# Altium schematic sheet POWER.SchDoc
size A4
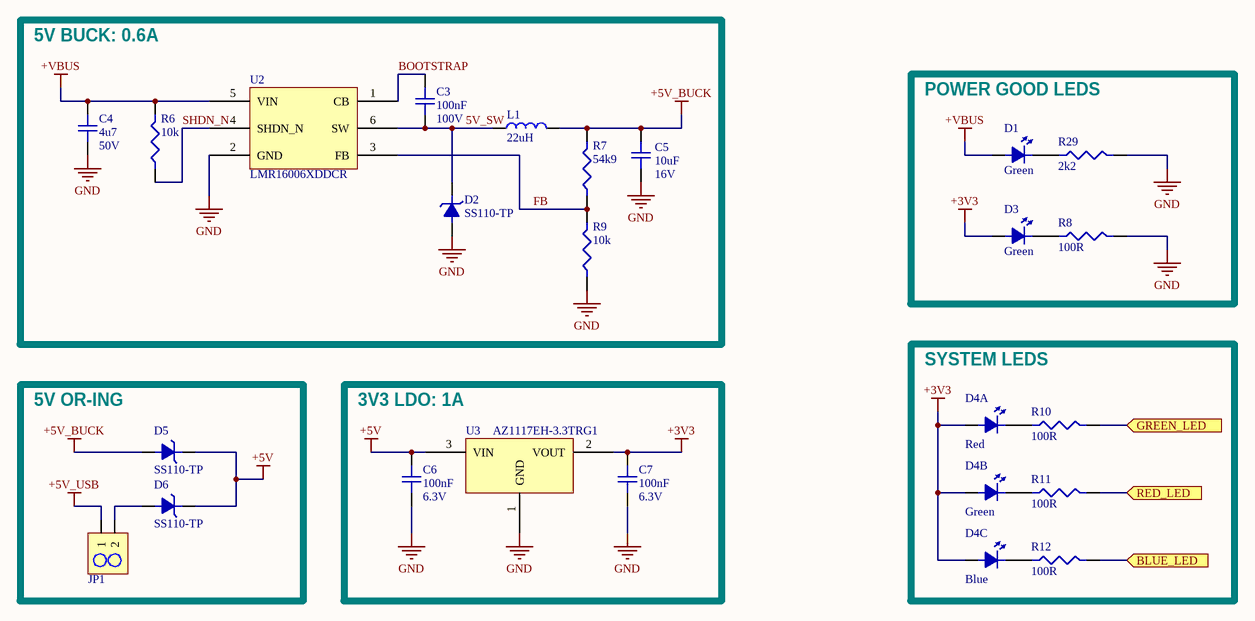
[diagram p0: POWER.SchDoc]

## Parts
C3  100nF  Voltage Rating: 100V  [C0805]
C4  4u7  Voltage Rating: 50V  [C0805]
C5  10uF  Voltage Rating: 16V  [C0805]
C6  100nF  Voltage Rating: 6.3V  [C0402]
C7  100nF  Voltage Rating: 6.3V  [C0402]
D1  Green  [LED_0603]
D2  SS110-TP  [DO-214AA_Diode]
D3  Green  [LED_0603]
D4  EAST1616RGBB4  [LED_TRICOLOR]  (value not drawn)  (parts A,B,C of 3)
D5  SS110-TP  [DO-214AA_Diode]
D6  SS110-TP  [DO-214AA_Diode]
JP1  952-2262-ND  [2PIN_HEADER]  (value not drawn)
L1  22uH  [INDUCTOR]
R6  10k  [R0402]
R7  54k9  [R0402]
R8  100R  [R0402]
R9  10k  [R0402]
R10  100R  [R0402]
R11  100R  [R0402]
R12  100R  [R0402]
R29  2k2  [R0402]
U2  LMR16006XDDCR  [SOT23-6_Lead]
U3  AZ1117EH-3.3TRG1  [SOT223]

## Blocks framed on the sheet
5V BUCK: 0.6A: C3-C5 D2 L1 R6 R7 R9 U2
POWER GOOD LEDS: D1 D3 R8 R29
SYSTEM LEDS: D4 R10-R12
5V OR-ING: D5 D6 JP1
3V3 LDO: 1A: C6 C7 U3

## Ports
BLUE_LED, GREEN_LED, RED_LED

## Nets
+3V3: C7.2 D3.1 D4.4 U3.2(VOUT)
+5V: C6.2 D5.2 D6.2 U3.3(VIN)
+5V_BUCK: C5.2 D5.1 L1.2 R7.2
+5V_USB: JP1.1
+VBUS: C4.2 D1.1 R6.2 U2.5(VIN)
GND: C4.1 C5.1 C6.1 C7.1 D2.1 R8.2 R9.1 R29.2 U2.2(GND) U3.1(GND)
5V_SW: C3.1 D2.2 L1.1 U2.6(SW)
BLUE_LED: R12.2 ; port BLUE_LED
BOOTSTRAP: C3.2 U2.1(CB)
FB: R7.1 R9.2 U2.3(FB)
GREEN_LED: R10.2 ; port GREEN_LED
RED_LED: R11.2 ; port RED_LED
SHDN_N: R6.1 U2.4(SHDN_N)
NetD1_2: D1.2 R29.1
NetD3_2: D3.2 R8.1
NetD4_1: D4.1 R10.1
NetD4_2: D4.2 R11.1
NetD4_3: D4.3 R12.1
NetD6_1: D6.1 JP1.2

## Notes on the sheet
- (in symbol EAST1616RGBB4, part A) Red
- (in symbol EAST1616RGBB4, part B) Green
- (in symbol EAST1616RGBB4, part C) Blue

## Library data of the parts
C3 = CL21B104KCFWPNE: CAP CER 0.10µF 100V Ceramic Capacitor X7R 0805 (2012 Metric) 0.079" L x 0.049" W (2.00mm x 1.25mm); Manufacturer: Samsung; Tolerance: 10%; Supplier 1: Digi-Key; Manufacturer Part Number: CL21B104KCFWPNE; Stock 1: 6000; Pricing 1: 1=0.17, 10=0.118, 100=0.0556, 500=0.039, 1000=0.0323 (USD); Mount: Surface Mount; Case/Package: 0805; Case Code (Metric): 2012; Case Code (Imperial): 0805; Min Operating Temperature: -55°C; Max Operating Temperature: 125°C; Packaging: Tape and Reel; Capacitance: 100nF; Length: 0.079inch; Width: 0.049inch; Thickness: 0.053inch; Supplier Part Number 1: 1276-6733-1-ND
C4 = CL21A475KBQNNNE: CAP CER 4.7uF 50V X5R 10% SMD 0805 85C Embossed T/R; Manufacturer: Samsung; Supplier 1: Digi-Key; Manufacturer Part Number: CL21A475KBQNNNE; Stock 1: 20000; Pricing 1: 1=0.44, 10=0.309, 100=0.1854, 500=0.1391, 1000=0.1174 (USD); Mount: Surface Mount; Case/Package: 0805; Case Code (Metric): 2012; Case Code (Imperial): 0805; Min Operating Temperature: -55°C; Max Operating Temperature: 85°C; Tolerance: 10%; Packaging: Tape and Reel; Package Quantity: 1; Capacitance: 4.7uF; Dielectric: X5R; Length: 2mm; Width: 0.049inch; Thickness: 0.055inch; Depth: 1.25mm; Radiation Hardening: No; ComponentLink1URL: https://datasheet.ciiva.com/25797/cl21a475kbqnnne-25797730.pdf; ComponentLink1Description: https://datasheet.ciiva.com/25797/cl21a475kbqnnne-25797730.pdf; ComponentLink2URL: https://datasheet.ciiva.com/26838/getdatasheetpartid-470982-26838620.pdf; ComponentLink2Description: https://datasheet.ciiva.com/26838/getdatasheetpartid-470982-26838620.pdf; ComponentLink3URL: https://datasheet.ciiva.com/16428/cl21a475kbqnnne-16428877.pdf; ComponentLink3Description: https://datasheet.ciiva.com/16428/cl21a475kbqnnne-16428877.pdf; Supplier Part Number 1: 1276-1248-1-ND
C5 = CL21A106KOQNNNE: CAP CER 10uF 16V X5R 10% SMD 0805 85C T/R; Manufacturer: Samsung; Dielectric: X7R; Supplier 1: Digi-Key; Manufacturer Part Number: CL21A106KOQNNNE; Stock 1: 20000; Pricing 1: 1=0.21, 10=0.148, 100=0.0698, 500=0.0489, 1000=0.0405 (USD); Mount: Surface Mount; Case/Package: 0805; Case Code (Metric): 2012; Case Code (Imperial): 0805; Min Operating Temperature: -55°C; Max Operating Temperature: 85°C; Package Quantity: 1; Packaging: Tape and Reel; Capacitance: 10uF; Tolerance: 10%; Voltage Rating (DC): 16V; Voltage: 16V; Length: 2mm; Height: 1.25mm; Width: 0.049inch; Thickness: 0.055inch; Depth: 1.25mm; Radiation Hardening: No; Lead Free: Lead Free; ComponentLink1URL: https://datasheet.ciiva.com/25798/cl21a106koqnnne-25798133.pdf; ComponentLink1Description: https://datasheet.ciiva.com/25798/cl21a106koqnnne-25798133.pdf; ComponentLink2URL: https://datasheet.ciiva.com/16740/cl05b104kq5nnnc-16740697.pdf; ComponentLink2Description: https://datasheet.ciiva.com/16740/cl05b104kq5nnnc-16740697.pdf; ComponentLink3URL: https://datasheet.ciiva.com/15216/getdatasheetpartid-358435-15216234.pdf; ComponentLink3Description: https://datasheet.ciiva.com/15216/getdatasheetpartid-358435-15216234.pdf; Supplier Part Number 1: 1276-1096-1-ND
C6 C7 = CL05B104KQ5NNNC: CAP CER 0.1uF 6.3V X7R 10% SMD 0402 125C Paper T/R; Manufacturer: Samsung; Supplier 1: Digi-Key; Manufacturer Part Number: CL05B104KQ5NNNC; Stock 1: 100000; Pricing 1: 1=0.1, 10=0.03, 100=0.0134, 500=0.0096, 1000=0.0075, 2500=0.0068, 5000=0.0063 (USD); Mount: Surface Mount; Case/Package: 0402; Case Code (Metric): 1005; Case Code (Imperial): 0402; Min Operating Temperature: -55°C; Max Operating Temperature: 125°C; Tolerance: 10%; Packaging: Tape and Reel; Capacitance: 100nF; Dielectric: X7R; Voltage Rating (DC): 6.3V; Length: 1mm; Height: 0.5mm; Width: 0.02inch; Thickness: 0.022inch; Depth: 0.5mm; Radiation Hardening: No; Lead Free: Lead Free; Supplier Part Number 1: 1276-1511-1-ND
D1 D3 = LTST-C191KGKT: LED GREEN CLEAR 0603 SMD; Manufacturer: Vishay Lite-On; Lens Colour: Clear,Colorless; Power Rating: 75mW; Luminous Intensity: 35mcd; Viewing Angle: 130°; Lens Style: Clear,Diffused,Colorless,Rectangular; Forward Current: 30mA; Forward Voltage: 2V; Dominant Wavelength: 571nm; Test Current: 20mA; Number of Elements: 1; Wavelength: 574nm; Supplier 1: Digi-Key; Manufacturer Part Number: LTST-C191KGKT; Stock 1: 1301664; Pricing 1: 1=0.29, 10=0.211, 25=0.1556, 100=0.1111, 250=0.0756, 500=0.0667, 1000=0.0522, 2500=0.0511 (USD); Mount: Surface Mount; Case/Package: 0603; Number of Pins: 2; Colour: Green; Case Code (Metric): 1608; Case Code (Imperial): 0603; Min Operating Temperature: -55°C; Max Operating Temperature: 85°C; Packaging: Tape and Reel; Package Quantity: 1; Illumination Colour: Green; Lens Transparency: Clear; Power Dissipation: 75mW; Number of LEDs: 1; Length: 1.6mm; Height: 0.55mm; Width: 0.8mm; Depth: 0.8mm; Radiation Hardening: No; Lead Free: Lead Free; ComponentLink1URL: https://datasheet.ciiva.com/12400/100-ltst-c191kgkt-53586-12400818.pdf; ComponentLink1Description: https://datasheet.ciiva.com/12400/100-ltst-c191kgkt-53586-12400818.pdf; ComponentLink2URL: https://datasheet.ciiva.com/2109/s-110-ltst-c191kgkt-2109973.pdf; ComponentLink2Description: https://datasheet.ciiva.com/2109/s-110-ltst-c191kgkt-2109973.pdf; ComponentLink3URL: https://datasheet.ciiva.com/2109/s-110-ltst-c191kgkt-2109974.pdf; ComponentLink3Description: https://datasheet.ciiva.com/2109/s-110-ltst-c191kgkt-2109974.pdf; ComponentLink4URL: https://datasheet.ciiva.com/2109/s-110-ltst-c191kgkt-2109975.pdf; ComponentLink4Description: https://datasheet.ciiva.com/2109/s-110-ltst-c191kgkt-2109975.pdf; ComponentLink5URL: https://datasheet.ciiva.com/15223/getdatasheetpartid-103913-15223276.pdf; ComponentLink5Description: https://datasheet.ciiva.com/15223/getdatasheetpartid-103913-15223276.pdf; ComponentLink6URL: https://datasheet.ciiva.com/11773/0900766b80dc02b1-11773629.pdf; ComponentLink6Description: https://datasheet.ciiva.com/11773/0900766b80dc02b1-11773629.pdf; ComponentLink7URL: https://datasheet.ciiva.com/16215/ltst-c191kgkt-16215151.pdf; ComponentLink7Description: https://datasheet.ciiva.com/16215/ltst-c191kgkt-16215151.pdf; Supplier Part Number 1: 160-1446-6-ND
D2 D5 D6 = SS110-TP: DIODE SCHOTTKY 100V 1A SMA; Manufacturer: MCC; Forward Voltage: 850mV; Max Surge Current: 30A; Peak Reverse Current: 20mA; Max Reverse Leakage Current: 500uA; Element Configuration: Single; Polarity: Standard; Capacitance: 30pF; Supplier 1: Digi-Key; Manufacturer Part Number: SS110-TP; Stock 1: 56746; Pricing 1: 1=0.41, 10=0.292, 100=0.172, 500=0.0973, 1000=0.0746 (USD); Mount: Surface Mount; Case/Package: SMA; Number of Pins: 2; Min Operating Temperature: -55°C; Max Operating Temperature: 125°C; Packaging: Tape and Reel; Forward Current: 1A; Package Quantity: 1; Average Rectified Current: 1A; Peak Non-Repetitive Surge Current: 30A; Max Repetitive Reverse Voltage (Vrrm): 100V; Max Forward Surge Current (Ifsm): 30A; Voltage Rating (DC): 100V; Current Rating: 1A; Output Current: 1A; Max Reverse Voltage (DC): 100V; Length: 4.57mm; Height: 2.44mm; Width: 2.84mm; Radiation Hardening: No; REACH SVHC: Unknown; Lead Free: Lead Free; ComponentLink1URL: https://datasheet.ciiva.com/7963/1684859-7963319.pdf; ComponentLink1Description: https://datasheet.ciiva.com/7963/1684859-7963319.pdf; ComponentLink2URL: https://datasheet.ciiva.com/16742/ss12-ss110hsma-16742536.pdf; ComponentLink2Description: https://datasheet.ciiva.com/16742/ss12-ss110hsma-16742536.pdf; ComponentLink3URL: https://datasheet.ciiva.com/912/ss12-ss110hsma-912300.pdf; ComponentLink3Description: https://datasheet.ciiva.com/912/ss12-ss110hsma-912300.pdf; ComponentLink4URL: https://datasheet.ciiva.com/912/ss12-ss110hsma-912301.pdf; ComponentLink4Description: https://datasheet.ciiva.com/912/ss12-ss110hsma-912301.pdf; ComponentLink5URL: https://datasheet.ciiva.com/28382/1684859-28382109.pdf; ComponentLink5Description: https://datasheet.ciiva.com/28382/1684859-28382109.pdf; ComponentLink6URL: https://datasheet.ciiva.com/912/ss12-ss110hsma-912302.pdf; ComponentLink6Description: https://datasheet.ciiva.com/912/ss12-ss110hsma-912302.pdf; Supplier Part Number 1: SS110-TPCT-ND
D4 = EAST1616RGBB4: LED TRICOLOR RED GREEN BLUE; Manufacturer: Everlight; Supplier 1: Digi-Key; Manufacturer Part Number: EAST1616RGBB4; Stock 1: 0; Supplier Part Number 1: 1080-1552-2-ND
JP1 = M20-9990246: CONN_HeaderPins2pos Headers & Wire Housings 02 SIL VERTICAL PIN HEADER TIN; Manufacturer: Harwin; Contact Resistance: 30mR; Max Current Rating: 3A; Number of Positions: 2; Gender: Male; Connector Type: Male Pin; Insulation Resistance: 10GR; Voltage Rating (AC): 750V; Pitch: 2.54mm; Supplier 1: Digi-Key; Manufacturer Part Number: M20-9990246; Stock 1: 53577; Pricing 1: 1=0.11, 10=0.099, 100=0.0609, 500=0.0504, 1000=0.0441, 5000=0.0378, 10000=0.0368 (USD); Case/Package: SIL; Colour: Black; Housing Colour: Black; Housing Material: Nylon; Contact Plating: Tin; Contact Material: Bronze,Brass; Min Operating Temperature: -40°C; Max Operating Temperature: 105°C; Package Quantity: 1000; Packaging: Bulk; Termination: Solder; Number of Rows: 1; Number of Contacts: 2; Orientation: Straight; Current Rating: 3A; Length: 5.08mm; Depth: 2.54mm; Contact Mating Length: 0.24inch; Radiation Hardening: No; REACH SVHC: No SVHC; ComponentLink1URL: https://datasheet.ciiva.com/8046/315376-8046930.pdf; ComponentLink1Description: https://datasheet.ciiva.com/8046/315376-8046930.pdf; ComponentLink2URL: https://datasheet.ciiva.com/6833/m20-999-6833368.pdf; ComponentLink2Description: https://datasheet.ciiva.com/6833/m20-999-6833368.pdf; ComponentLink3URL: https://datasheet.ciiva.com/11745/0900766b81034e61-11745755.pdf; ComponentLink3Description: https://datasheet.ciiva.com/11745/0900766b81034e61-11745755.pdf; ComponentLink4URL: https://datasheet.ciiva.com/22660/1830818-22660571.pdf; ComponentLink4Description: https://datasheet.ciiva.com/22660/1830818-22660571.pdf; ComponentLink5URL: https://datasheet.ciiva.com/26852/getdatasheetpartid-384170-26852203.pdf; ComponentLink5Description: https://datasheet.ciiva.com/26852/getdatasheetpartid-384170-26852203.pdf; Supplier Part Number 1: 952-2262-ND
L1 = 74404043220A: INDUCTOR SHIELDED; Manufacturer: Wurth Electronics; Supplier 1: Digi-Key; Manufacturer Part Number: 74404043220A; Stock 1: 12022; Pricing 1: 1=0.6, 50=0.4958, 100=0.3769, 1000=0.3273 (USD); Supplier Part Number 1: 732-10762-1-ND
R6 R9 = RC0402JR-0710KL: RES SMD 10K OHM 5% 1/16W 0402; Manufacturer: Yageo; Resistance: 10kR; Power Rating: 62.5mW; Voltage Rating: 50V; Temperature Coefficient: 100ppm/°C; Max Power Dissipation: 63mW; Supplier 1: Digi-Key; Manufacturer Part Number: RC0402JR-0710KL; Stock 1: 47303622; Pricing 1: 1=0.1, 10=0.018, 100=0.0073, 1000=0.0033, 2500=0.0029, 5000=0.0024 (USD); Case/Package: 0402; Case Code (Metric): 1005; Case Code (Imperial): 0402; Min Operating Temperature: -55°C; Max Operating Temperature: 155°C; Packaging: Tape and Reel; Tolerance: 5%; Package Quantity: 1; Composition: Thick Film; Number of Terminations: 2; Termination: SMD/SMT; Military Standard: Not; Features: Moisture Resistant; Length: 1mm; Height: 0.016inch; Width: 0.02inch; Depth: 0.5mm; REACH SVHC: Unknown; Lead Free: Lead Free; Supplier Part Number 1: 311-10KJRCT-ND
R7 = ERJ-2RKF54R9X: RES SMD 54.9K OHM 1/10W 0402 54.9 Ohm 1% 0.1W(1/10W) ±100ppm/C Molded SMD Automotive Punched T/R; Manufacturer: Panasonic; Resistance: 54.9R; Power Rating: 100mW; Voltage Rating: 50V; Temperature Coefficient: 100ppm/°C; Supplier 1: Digi-Key; Manufacturer Part Number: ERJ-2RKF54R9X; Stock 1: 343302; Pricing 1: 1=0.1, 10=0.056, 100=0.0227, 1000=0.0102, 2500=0.0089, 5000=0.0073 (USD); Mount: Surface Mount; Case/Package: 0402; Case Code (Metric): 1005; Case Code (Imperial): 0402; Contact Plating: Tin; Min Operating Temperature: -55°C; Max Operating Temperature: 155°C; Tolerance: 1%; Packaging: Tape and Reel; Package Quantity: 1; Composition: Thick Film; Number of Terminations: 2; Termination: SMD/SMT; Military Standard: Not; Max Power Dissipation: 100mW; Voltage Rating (DC): 50V; Features: Automotive AEC-Q200; Length: 1mm; Height: 0.016inch; Width: 0.02inch; Depth: 0.5mm; REACH SVHC: No SVHC; Lead Free: Lead Free; Supplier Part Number 1: P54.9LCT-ND
R8 R10-R12 = RC0402JR-07100RL: RES SMD 100 OHM 5% 1/16W 0402; Manufacturer: Yageo; Power Rating: 63mW; Voltage Rating: 50V; Temperature Coefficient: 100ppm/°C; Supplier 1: Digi-Key; Manufacturer Part Number: RC0402JR-07100RL; Stock 1: 447099; Pricing 1: 1=0.1, 10=0.015, 100=0.006, 1000=0.0027, 2500=0.0023, 5000=0.0019 (USD); Case/Package: 0402; Weight: 2.3E-05oz; Case Code (Metric): 1005; Case Code (Imperial): 0402; Min Operating Temperature: -55°C; Max Operating Temperature: 155°C; Resistance: 100R; Tolerance: 5%; Packaging: Tape and Reel; Package Quantity: 1; Composition: Thick Film; Number of Terminations: 2; Termination: SMD/SMT; Military Standard: Not; Max Power Dissipation: 63mW; Features: Moisture Resistant; Length: 1mm; Height: 0.016inch; Width: 0.02inch; Depth: 0.5mm; REACH SVHC: No SVHC; Lead Free: Lead Free; Supplier Part Number 1: 311-100JRCT-ND
R29 = RC0402JR-072K2L: RES SMD 2.2K OHM 5% 1/16W 0402; Manufacturer: Yageo; Resistance: 2.2kR; Power Rating: 63mW; Voltage Rating: 50V; Temperature Coefficient: 100ppm/°C; Supplier 1: Digi-Key; Manufacturer Part Number: RC0402JR-072K2L; Stock 1: 7890813; Pricing 1: 1=0.1, 10=0.018, 100=0.0073, 1000=0.0033, 2500=0.0029, 5000=0.0024 (USD); Case/Package: 0402; Weight: 2.3E-05oz; Case Code (Metric): 1005; Case Code (Imperial): 0402; Min Operating Temperature: -55°C; Max Operating Temperature: 155°C; Tolerance: 5%; Packaging: Tape and Reel; Composition: Thick Film; Termination: SMD/SMT; Military Standard: Not; Package Quantity: 1; Number of Terminations: 2; Max Power Dissipation: 63mW; Working Voltage: 50V; Features: Moisture Resistant; Length: 1mm; Height: 0.016inch; Depth: 0.5mm; Width: 0.02inch; REACH SVHC: Unknown; Lead Free: Lead Free; Supplier Part Number 1: 311-2.2KJRCT-ND
U2 = LMR16006XDDCR: IC BUCK 3V3 REGULATOR 0.6A Conv DC-DC 1-OUT Step Down 4V 60V 6-Pin SOT T/R; Manufacturer: Texas Instruments; Number of Outputs: 1; Output Voltage: 55V; Max Output Current: 600mA; Min Output Voltage: 765mV; Switching Frequency: 700kHz; Synchronous Rectifier: No; Quiescent Current: 28uA; Supplier 1: Digi-Key; Manufacturer Part Number: LMR16006XDDCR; Stock 1: 5; Pricing 1: 1=2.88, 10=2.589, 100=2.121, 500=1.8055, 1000=1.5228 (USD); Mount: Surface Mount; Case/Package: SOT-23-6; Number of Pins: 6; Contact Plating: Nickel,Gold; Min Operating Temperature: -40°C; Max Operating Temperature: 125°C; Min Input Voltage: 4V; Max Input Voltage: 60V; Packaging: Tape and Reel; Max Output Voltage: 55V; Output Current: 600mA; Operating Supply Voltage: 60V; REACH SVHC: No SVHC; Lead Free: Lead Free; Supplier Part Number 1: 296-40293-1-ND
U3 = AZ1117EH-3.3TRG1: IC LDO 3V3 1A Voltage Regulators LDO BJT HiCurr; Manufacturer: Diodes; Output Voltage: 3.3V; Dropout Voltage: 1.1V; Number of Regulators: 1; Max Input Voltage: 13V; Operating Supply Current: 3.5mA; Power Supply Rejection Ratio (PSRR): 70dB; Polarity: Positive; Accuracy: 1%; Reference Voltage: 1.262V; Supplier 1: Digi-Key; Manufacturer Part Number: AZ1117EH-3.3TRG1; Stock 1: 105343; Pricing 1: 1=0.43, 10=0.321, 100=0.1815, 500=0.1202, 1000=0.0922 (USD); Mount: Surface Mount; Case/Package: TO-261-4; Number of Pins: 3; Weight: 0.000282oz; Contact Plating: Tin; Min Operating Temperature: -40°C; Max Operating Temperature: 125°C; Packaging: Tape and Reel; Output Current: 1A; Number of Outputs: 1; Package Quantity: 4000; Quiescent Current: 3.5mA; Max Output Current: 1A; Lead Free: Lead Free; Supplier Part Number 1: AZ1117EH-3.3TRG1DICT-ND